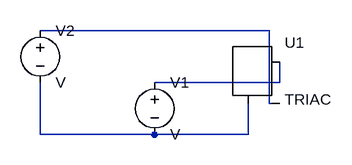
[diagram p0: schematic ElectronicsLab3 step#3.asc]
ElectronicsLab3 step#3.asc, the LTspice schematic file:
Version 4
SHEET 1 880 680
WIRE 272 112 -80 112
WIRE 288 192 288 160
WIRE 288 192 96 192
WIRE 272 224 272 112
WIRE 288 224 272 224
WIRE -80 272 -80 192
WIRE 96 272 -80 272
WIRE 240 272 240 224
WIRE 240 272 96 272
SYMBOL voltage 96 176 R0
SYMATTR InstName V1
SYMBOL voltage -80 96 R0
SYMATTR InstName V2
SYMBOL TRIAC 256 160 R0
SYMATTR InstName U1

The netlist it stands for:
* ElectronicsLab3 step#3.asc
V1 N002 N003 V
V2 N001 N003 V
XU1 N002 N003 N001 TRIAC  ; pins MT2 G MT1
.backanno
.end